# Altium schematic sheet Columns.SchDoc
size A4; DocumentNumber: 3; SheetNumber: 3; SheetTotal: 3
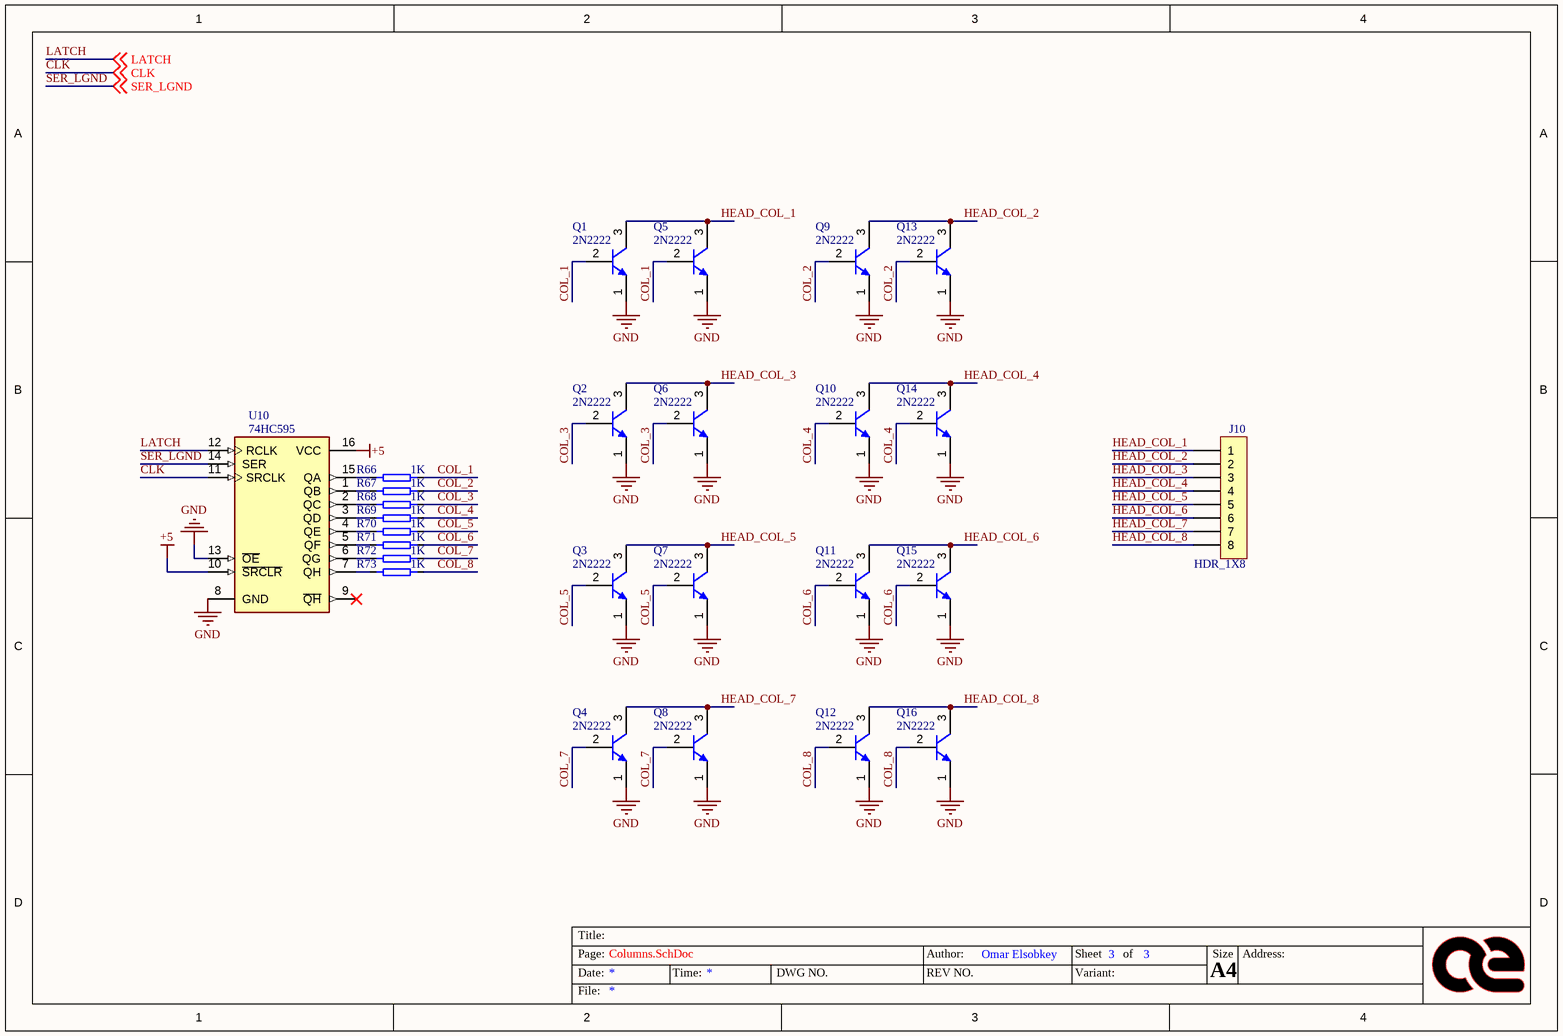
[diagram p0: Columns.SchDoc]

## Parts
J10  HDR_1X8  [HDR_1X8_2.54MM]
Q1  2N2222  [TO92_WIDE]
Q2  2N2222  [TO92_WIDE]
Q3  2N2222  [TO92_WIDE]
Q4  2N2222  [TO92_WIDE]
Q5  2N2222  [TO92_WIDE]
Q6  2N2222  [TO92_WIDE]
Q7  2N2222  [TO92_WIDE]
Q8  2N2222  [TO92_WIDE]
Q9  2N2222  [TO92_WIDE]
Q10  2N2222  [TO92_WIDE]
Q11  2N2222  [TO92_WIDE]
Q12  2N2222  [TO92_WIDE]
Q13  2N2222  [TO92_WIDE]
Q14  2N2222  [TO92_WIDE]
Q15  2N2222  [TO92_WIDE]
Q16  2N2222  [TO92_WIDE]
R66  1K  [R_AXIAL_0.3MM]
R67  1K  [R_AXIAL_0.3MM]
R68  1K  [R_AXIAL_0.3MM]
R69  1K  [R_AXIAL_0.3MM]
R70  1K  [R_AXIAL_0.3MM]
R71  1K  [R_AXIAL_0.3MM]
R72  1K  [R_AXIAL_0.3MM]
R73  1K  [R_AXIAL_0.3MM]
U10  74HC595  [DIP16]

## Nets
+5: U10.10(~{SRCLR}) U10.16(VCC)
GND: Q1.1(E) Q2.1(E) Q3.1(E) Q4.1(E) Q5.1(E) Q6.1(E) Q7.1(E) Q8.1(E) Q9.1(E) Q10.1(E) Q11.1(E) Q12.1(E) Q13.1(E) Q14.1(E) Q15.1(E) Q16.1(E) U10.8(GND) U10.13(~{OE})
CLK: U10.11(SRCLK) ; off-sheet CLK
COL_1: Q1.2(B) Q5.2(B) R66.2
COL_2: Q9.2(B) Q13.2(B) R67.2
COL_3: Q2.2(B) Q6.2(B) R68.2
COL_4: Q10.2(B) Q14.2(B) R69.2
COL_5: Q3.2(B) Q7.2(B) R70.2
COL_6: Q11.2(B) Q15.2(B) R71.2
COL_7: Q4.2(B) Q8.2(B) R72.2
COL_8: Q12.2(B) Q16.2(B) R73.2
HEAD_COL_1: J10.1 Q1.3(C) Q5.3(C)
HEAD_COL_2: J10.2 Q9.3(C) Q13.3(C)
HEAD_COL_3: J10.3 Q2.3(C) Q6.3(C)
HEAD_COL_4: J10.4 Q10.3(C) Q14.3(C)
HEAD_COL_5: J10.5 Q3.3(C) Q7.3(C)
HEAD_COL_6: J10.6 Q11.3(C) Q15.3(C)
HEAD_COL_7: J10.7 Q4.3(C) Q8.3(C)
HEAD_COL_8: J10.8 Q12.3(C) Q16.3(C)
LATCH: U10.12(RCLK) ; off-sheet LATCH
SER_LGND: U10.14(SER) ; off-sheet SER_LGND
NetR66_1: R66.1 U10.15(QA)
NetR67_1: R67.1 U10.1(QB)
NetR68_1: R68.1 U10.2(QC)
NetR69_1: R69.1 U10.3(QD)
NetR70_1: R70.1 U10.4(QE)
NetR71_1: R71.1 U10.5(QF)
NetR72_1: R72.1 U10.6(QG)
NetR73_1: R73.1 U10.7(QH)

Not connected (* = marked no-connect by the designer): U10 9(~{QH})*

## Notes on the sheet
- Title:
- Page:
- Date:
- Time:
- DWG NO.
- Author:
- REV NO.
- Omar Elsobkey
- Sheet       of
- Variant:
- A4
- Size
- Address:
- File:

## Library data of the parts
J10 = HDR_1X8: Male Hedader 1x8
Q1-Q16 = 2N2222: Amplifier Transistor, NPN Silicon, 3-Pin TO-92, Pb-Free, Bulk Box; PartNumber: P2N2222AG; Manufacturer: On Semiconductor; IC Continuous (A): 0.6; fT Min (MHz): 300; ComponentLink2Description: Datasheet; ComponentLink1Description: Manufacturer URL; ComponentLink2URL: http://www.onsemi.com/pub_link/Collateral/P2N2222A-D.PDF; ComponentLink3Description: Package Specification; RoHS: TRUE; ComponentLink1URL: http://www.onsemi.com/; Mounting Technology: Through Hole; PackageReference: TO-92-3-29-11_AM_SL; Polarity: NPN; Packing: Bulk Box; DatasheetVersion: Rev. 7; PackageDescription: 3-Pin Transistor Outline, Body 4.825 x 3.685 mm, Pitch 1.27 mm; PackageVersion: Rev. AM; ComponentLink3URL: http://www.onsemi.cn/pub_link/Collateral/2N6426-D.PDF
R66-R73 = R 1K
U10 = 74HC595: Shift Register 74595; MP: CD74HC595E; Package: None; Price: None; Value: *; Availability: Unavailable